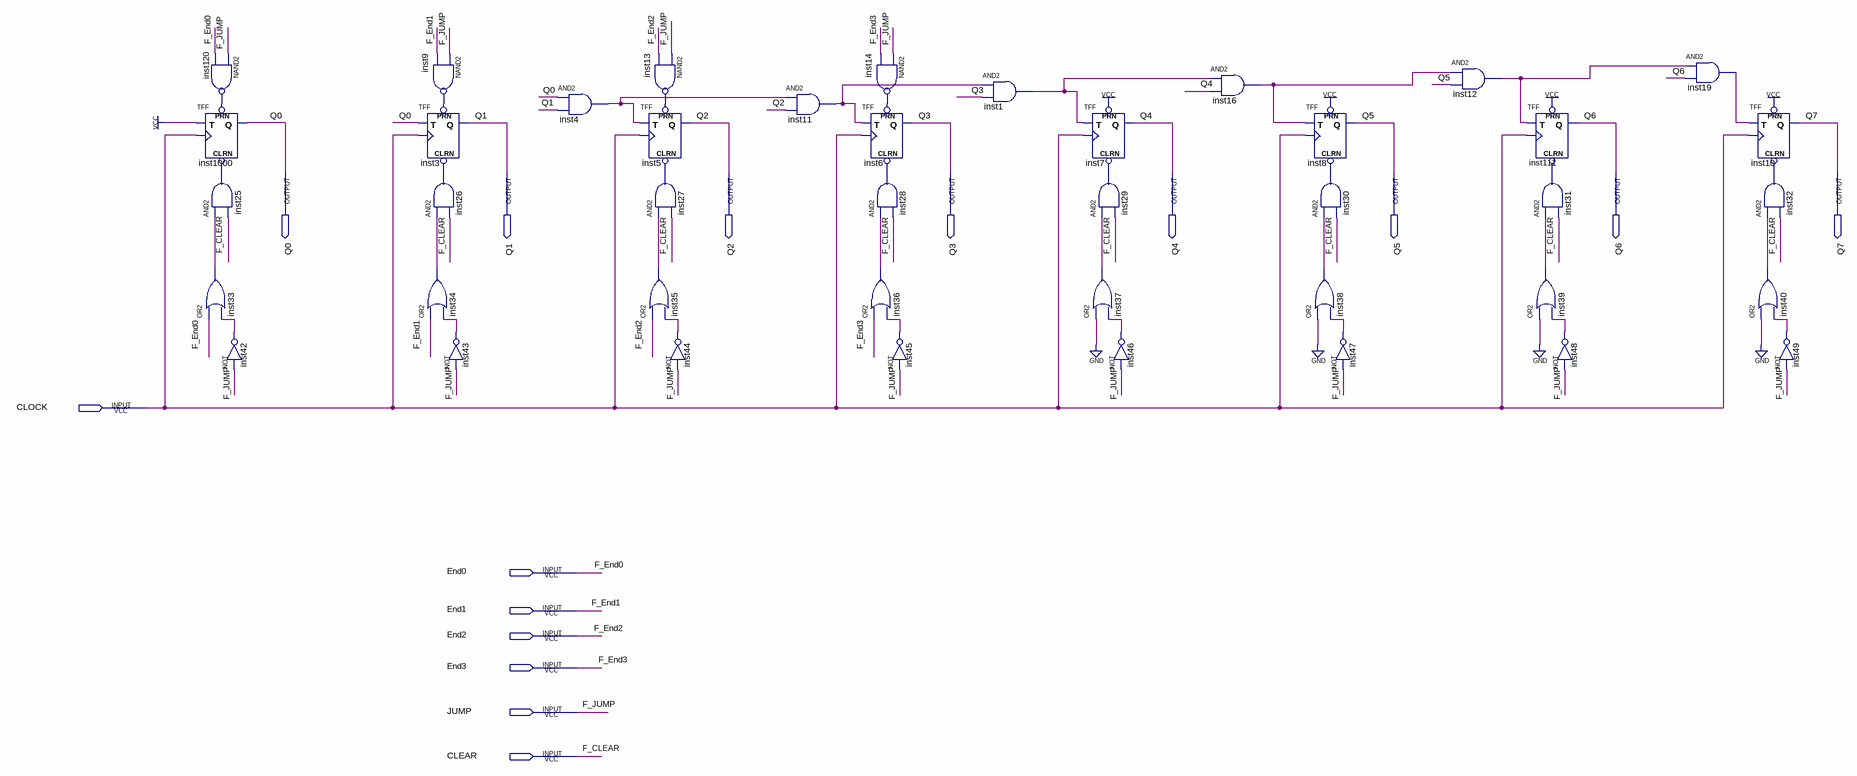
[diagram p0: schematic sheet]
// Quartus schematic Cont8Bits.bdf as structural Verilog: 42 symbols, 15 pins
module Cont8Bits (
  input  CLOCK,
  input  End0,
  input  End1,
  input  End2,
  input  End3,
  input  JUMP,
  input  CLEAR,
  output Q0,
  output Q1,
  output Q2,
  output Q3,
  output Q4,
  output Q5,
  output Q6,
  output Q7
);

  wire inst1_out, inst4_out, inst9_out, inst11_out, inst12_out, inst13_out, inst14_out, inst16_out,
       inst19_out, inst25_out, inst26_out, inst27_out, inst28_out, inst29_out, inst30_out, inst31_out,
       inst32_out, inst33_out, inst34_out, inst35_out, inst36_out, inst37_out, inst38_out, inst39_out,
       inst40_out, inst42_out, inst43_out, inst44_out, inst45_out, inst46_out, inst47_out, inst48_out,
       inst49_out, inst120_out;

  nand inst120 (inst120_out, JUMP, End0);
  TFF inst1000 (.PRN(inst120_out), .CLRN(inst25_out), .T(1'b1), .CLK(CLOCK), .Q(Q0));
  and inst25 (inst25_out, inst33_out, CLEAR);
  or inst33 (inst33_out, End0, inst42_out);
  not inst42 (inst42_out, JUMP);
  nand inst9 (inst9_out, JUMP, End1);
  TFF inst3 (.PRN(inst9_out), .CLRN(inst26_out), .T(Q0), .CLK(CLOCK), .Q(Q1));
  and inst26 (inst26_out, inst34_out, CLEAR);
  or inst34 (inst34_out, End1, inst43_out);
  not inst43 (inst43_out, JUMP);
  and inst4 (inst4_out, Q0, Q1);
  nand inst13 (inst13_out, JUMP, End2);
  TFF inst5 (.PRN(inst13_out), .CLRN(inst27_out), .T(inst4_out), .CLK(CLOCK), .Q(Q2));
  and inst27 (inst27_out, inst35_out, CLEAR);
  or inst35 (inst35_out, End2, inst44_out);
  not inst44 (inst44_out, JUMP);
  and inst11 (inst11_out, inst4_out, Q2);
  nand inst14 (inst14_out, JUMP, End3);
  TFF inst6 (.PRN(inst14_out), .CLRN(inst28_out), .T(inst11_out), .CLK(CLOCK), .Q(Q3));
  and inst28 (inst28_out, inst36_out, CLEAR);
  or inst36 (inst36_out, End3, inst45_out);
  not inst45 (inst45_out, JUMP);
  and inst1 (inst1_out, inst11_out, Q3);
  TFF inst7 (.PRN(1'b1), .CLRN(inst29_out), .T(inst1_out), .CLK(CLOCK), .Q(Q4));
  and inst29 (inst29_out, inst37_out, CLEAR);
  or inst37 (inst37_out, 1'b0, inst46_out);
  not inst46 (inst46_out, JUMP);
  and inst16 (inst16_out, inst1_out, Q4);
  TFF inst8 (.PRN(1'b1), .CLRN(inst30_out), .T(inst16_out), .CLK(CLOCK), .Q(Q5));
  and inst30 (inst30_out, inst38_out, CLEAR);
  or inst38 (inst38_out, 1'b0, inst47_out);
  not inst47 (inst47_out, JUMP);
  and inst12 (inst12_out, inst16_out, Q5);
  TFF inst111 (.PRN(1'b1), .CLRN(inst31_out), .T(inst12_out), .CLK(CLOCK), .Q(Q6));
  and inst31 (inst31_out, inst39_out, CLEAR);
  or inst39 (inst39_out, 1'b0, inst48_out);
  not inst48 (inst48_out, JUMP);
  and inst19 (inst19_out, inst12_out, Q6);
  TFF inst10 (.PRN(1'b1), .CLRN(inst32_out), .T(inst19_out), .CLK(CLOCK), .Q(Q7));
  or inst40 (inst40_out, 1'b0, inst49_out);
  and inst32 (inst32_out, inst40_out, CLEAR);
  not inst49 (inst49_out, JUMP);

  // Other names for the same wires on the sheet: F_CLEAR = CLEAR; F_End0 = End0; F_End1 = End1; F_End2 = End2;
  //   F_End3 = End3; F_JUMP = JUMP
endmodule
